# Altium schematic sheet fillcap_mc.SchDoc: Microcontroller
size A3; DrawnBy: daniw / ninux; Organization: HSLU T&A; Address1: Abteilung Elektrotechnik; Address2: Technikumsstrasse 21; Address3: CH-6048 Horw; SheetNumber: 8; SheetTotal: 9; Projektname: fillcap
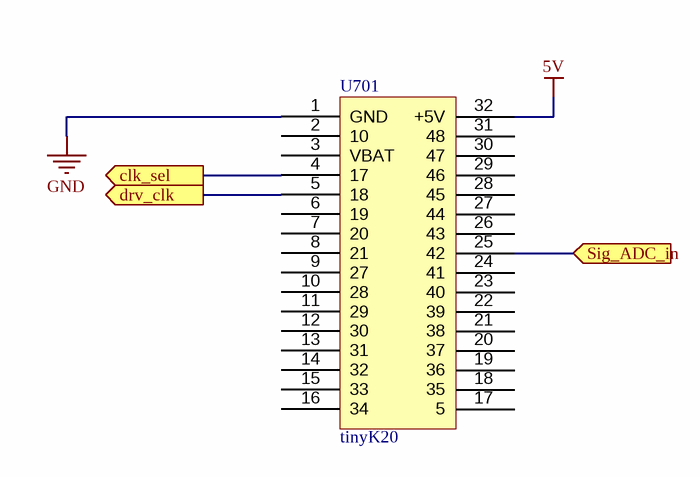
[diagram p0: fillcap_mc.SchDoc]

## Parts
U701  tinyK20  [tinyK20_full_mount]

## Ports
clk_sel (out), drv_clk (out), Sig_ADC_in (in)

## Nets
5V: U701.32(+5V)
GND: U701.1(GND)
clk_sel: U701.4(17) ; port clk_sel
drv_clk: U701.5(18) ; port drv_clk
Sig_ADC_in: U701.25(42) ; port Sig_ADC_in

Not connected (* = marked no-connect by the designer): U701 2(10) 3(VBAT) 6(19) 7(20) 8(21) 9(27) 10(28) 11(29) 12(30) 13(31) 14(32) 15(33) 16(34) 17(5) 18(35) 19(36) 20(37) 21(38) 22(39) 23(40) 24(41) 26(43) 27(44) 28(45) 29(46) 30(47) 31(48)

## Notes on the sheet
- Project:
- Drawn by:
- Size:
- Sheet
- A3
- Rev.:
- of
- Date:
- File: